# Altium schematic sheet PROC_partB_(LCD).SchDoc
size 254 x 254 mm
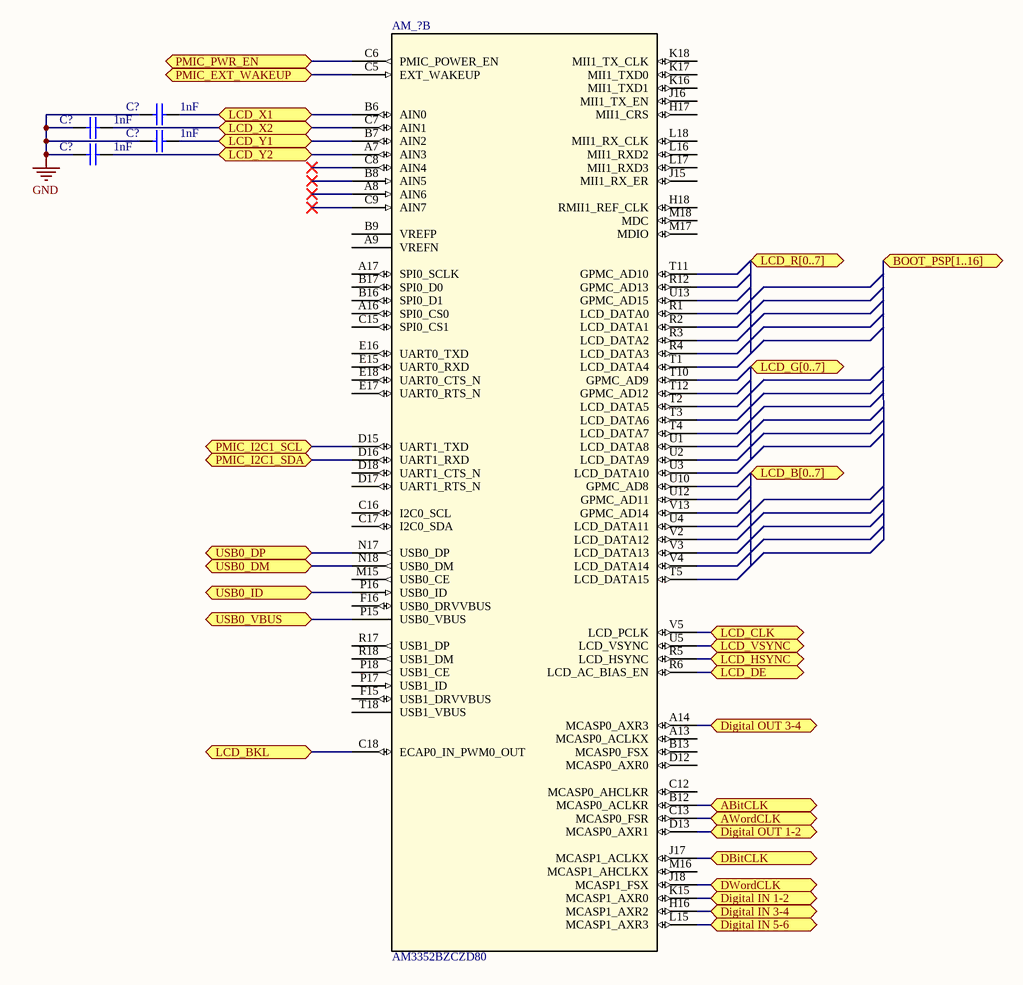
[diagram p0: PROC_partB_(LCD).SchDoc]

## Parts
(Parts that share a designator on the sheet are numbered #1, #2 ... from top to bottom, then left to right.)
AM_?  AM3352BZCZD80  [BGA324C80P18X18_800X1508X1508]  (part B of 4)
C?#1  value 1nF  [RAD-0.3]  (hidden comment: Cap)
C?#2  value 1nF  [RAD-0.3]  (hidden comment: Cap)
C?#3  value 1nF  [RAD-0.3]  (hidden comment: Cap)
C?#4  value 1nF  [RAD-0.3]  (hidden comment: Cap)

## Ports
ABitCLK, AWordCLK, BOOT_PSP[1..16], DBitCLK, Digital IN 1-2, Digital IN 3-4, Digital IN 5-6, Digital OUT 1-2, Digital OUT 3-4, DWordCLK, LCD_B[0..7], LCD_BKL, LCD_CLK, LCD_DE, LCD_G[0..7], LCD_HSYNC, LCD_R[0..7], LCD_VSYNC, LCD_X1, LCD_X2, LCD_Y1, LCD_Y2, PMIC_EXT_WAKEUP, PMIC_I2C1_SCL, PMIC_I2C1_SDA, PMIC_PWR_EN, USB0_DM, USB0_DP, USB0_ID, USB0_VBUS

## Nets
GND: C?#1.1 C?#2.1 C?#3.1 C?#4.1
ABitCLK: AM_?.B12(MCASP0_ACLKR) ; port ABitCLK
AWordCLK: AM_?.C13(MCASP0_FSR) ; port AWordCLK
DBitCLK: AM_?.J17(MCASP1_ACLKX) ; port DBitCLK
Digital IN 1-2: AM_?.K15(MCASP1_AXR0) ; port Digital IN 1-2
Digital IN 3-4: AM_?.H16(MCASP1_AXR2) ; port Digital IN 3-4
Digital IN 5-6: AM_?.L15(MCASP1_AXR3) ; port Digital IN 5-6
Digital OUT 1-2: AM_?.D13(MCASP0_AXR1) ; port Digital OUT 1-2
Digital OUT 3-4: AM_?.A14(MCASP0_AXR3) ; port Digital OUT 3-4
DWordCLK: AM_?.J18(MCASP1_FSX) ; port DWordCLK
LCD_BKL: AM_?.C18(ECAP0_IN_PWM0_OUT) ; port LCD_BKL
LCD_CLK: AM_?.V5(LCD_PCLK) ; port LCD_CLK
LCD_DE: AM_?.R6(LCD_AC_BIAS_EN) ; port LCD_DE
LCD_HSYNC: AM_?.R5(LCD_HSYNC) ; port LCD_HSYNC
LCD_VSYNC: AM_?.U5(LCD_VSYNC) ; port LCD_VSYNC
LCD_X1: AM_?.B6(AIN0) C?#1.2 ; port LCD_X1
LCD_X2: AM_?.C7(AIN1) C?#2.2 ; port LCD_X2
LCD_Y1: AM_?.B7(AIN2) C?#3.2 ; port LCD_Y1
LCD_Y2: AM_?.A7(AIN3) C?#4.2 ; port LCD_Y2
PMIC_EXT_WAKEUP: AM_?.C5(EXT_WAKEUP) ; port PMIC_EXT_WAKEUP
PMIC_I2C1_SCL: AM_?.D15(UART1_TXD) ; port PMIC_I2C1_SCL
PMIC_I2C1_SDA: AM_?.D16(UART1_RXD) ; port PMIC_I2C1_SDA
PMIC_PWR_EN: AM_?.C6(PMIC_POWER_EN) ; port PMIC_PWR_EN
USB0_DM: AM_?.N18(USB0_DM) ; port USB0_DM
USB0_DP: AM_?.N17(USB0_DP) ; port USB0_DP
USB0_ID: AM_?.P16(USB0_ID) ; port USB0_ID
USB0_VBUS: AM_?.P15(USB0_VBUS) ; port USB0_VBUS

Not connected (* = marked no-connect by the designer): AM_? A8(AIN6)* A9(VREFN) A13(MCASP0_ACLKX) A16(SPI0_CS0) A17(SPI0_SCLK) B8(AIN5)* B9(VREFP) B13(MCASP0_FSX) B16(SPI0_D1) B17(SPI0_D0) C8(AIN4)* C9(AIN7)* C12(MCASP0_AHCLKR) C15(SPI0_CS1) C16(I2C0_SCL) C17(I2C0_SDA) D12(MCASP0_AXR0) D17(UART1_RTS_N) D18(UART1_CTS_N) E15(UART0_RXD) E16(UART0_TXD) E17(UART0_RTS_N) E18(UART0_CTS_N) F15(USB1_DRVVBUS) F16(USB0_DRVVBUS) H17(MII1_CRS) H18(RMII1_REF_CLK) J15(MII1_RX_ER) J16(MII1_TX_EN) K16(MII1_TXD1) K17(MII1_TXD0) K18(MII1_TX_CLK) L16(MII1_RXD2) L17(MII1_RXD3) L18(MII1_RX_CLK) M15(USB0_CE) M16(MCASP1_AHCLKX) M17(MDIO) M18(MDC) P17(USB1_ID) P18(USB1_CE) R1(LCD_DATA0) R2(LCD_DATA1) R3(LCD_DATA2) R4(LCD_DATA3) R12(GPMC_AD13) R17(USB1_DP) R18(USB1_DM) T1(LCD_DATA4) T2(LCD_DATA5) T3(LCD_DATA6) T4(LCD_DATA7) T5(LCD_DATA15) T10(GPMC_AD9) T11(GPMC_AD10) T12(GPMC_AD12) T18(USB1_VBUS) U1(LCD_DATA8) U2(LCD_DATA9) U3(LCD_DATA10) U4(LCD_DATA11) U10(GPMC_AD8) U12(GPMC_AD11) U13(GPMC_AD15) V2(LCD_DATA12) V3(LCD_DATA13) V4(LCD_DATA14) V13(GPMC_AD14)

## Library data of the parts
AM_? = AM3352BZCZD80: Microprocesseur ARM; Fabricant: Texas Instrument; Fournisseur: Farnell; RefFabricant: AM3352BZCZ100; RefFournisseur: 2494119; Value: Value
C?#1-C?#4 = Cap: Capacitor